# Altium project VISION_BETA_EBB.PrjPcb (part 8 of 9)

## Sheet PWR_MGMT_CAN_IF.SchDoc
size D; SheetNumber: 16; SheetTotal: 19
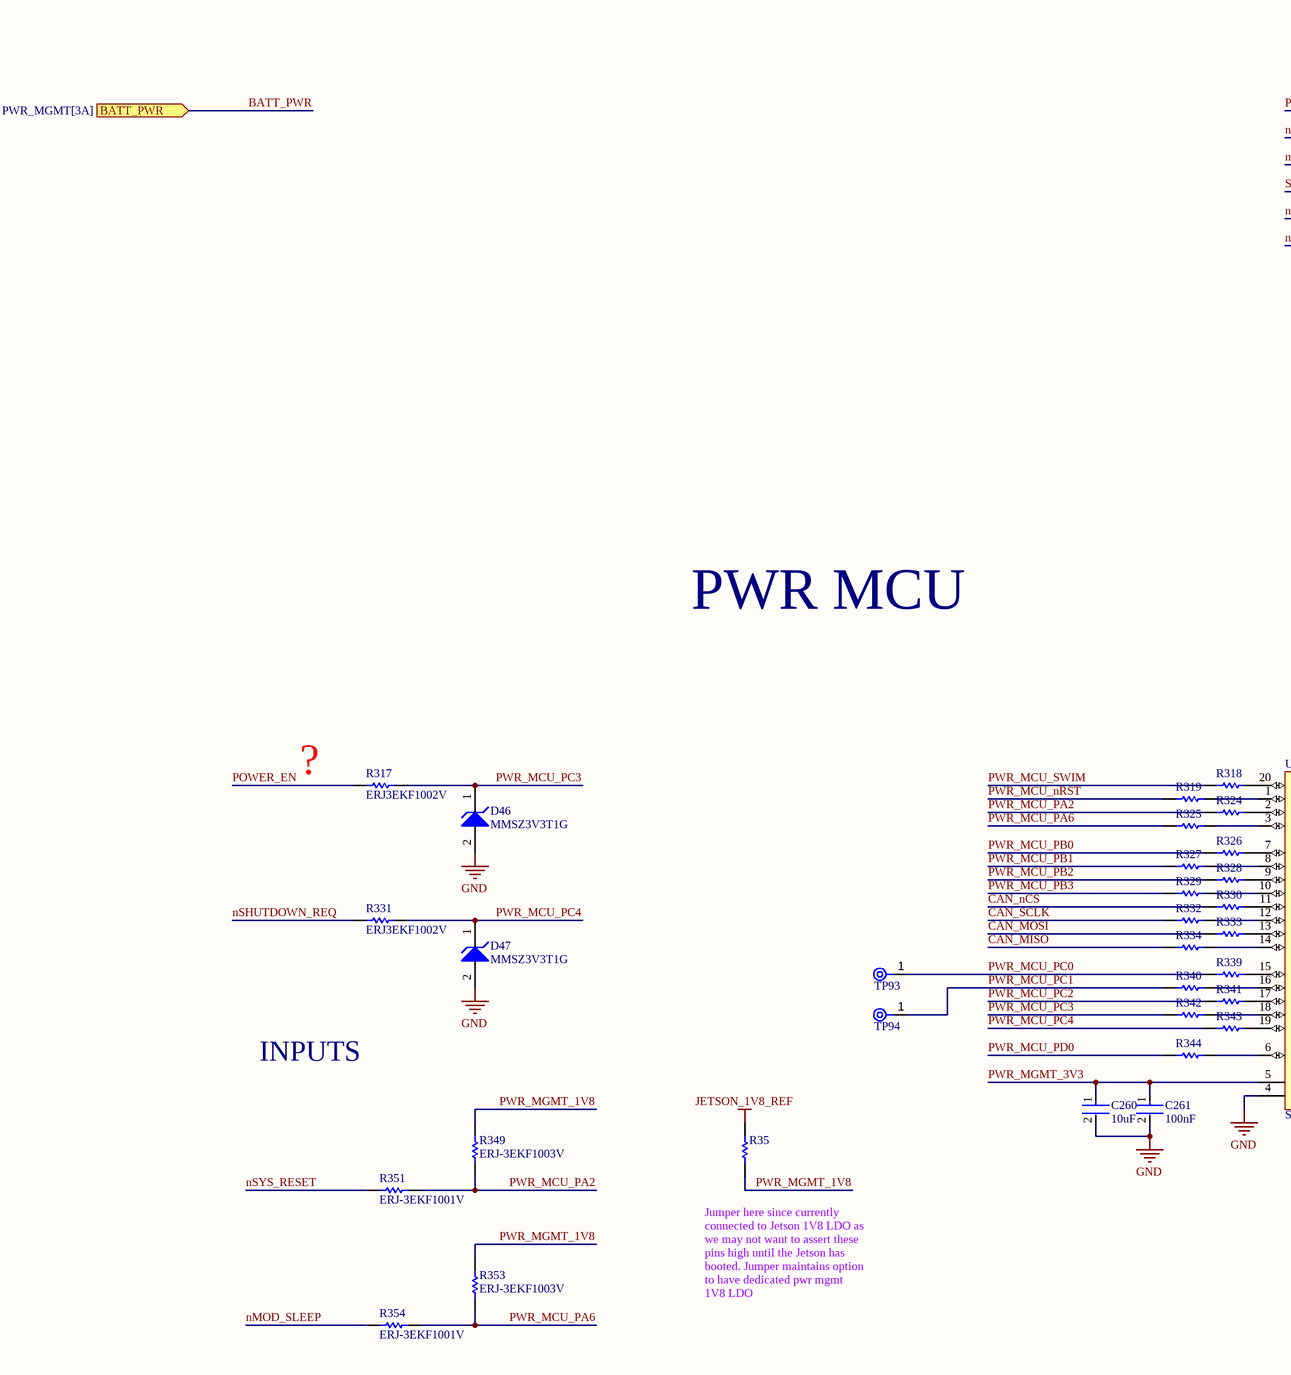
[diagram p39: PWR_MGMT_CAN_IF.SchDoc, top left]
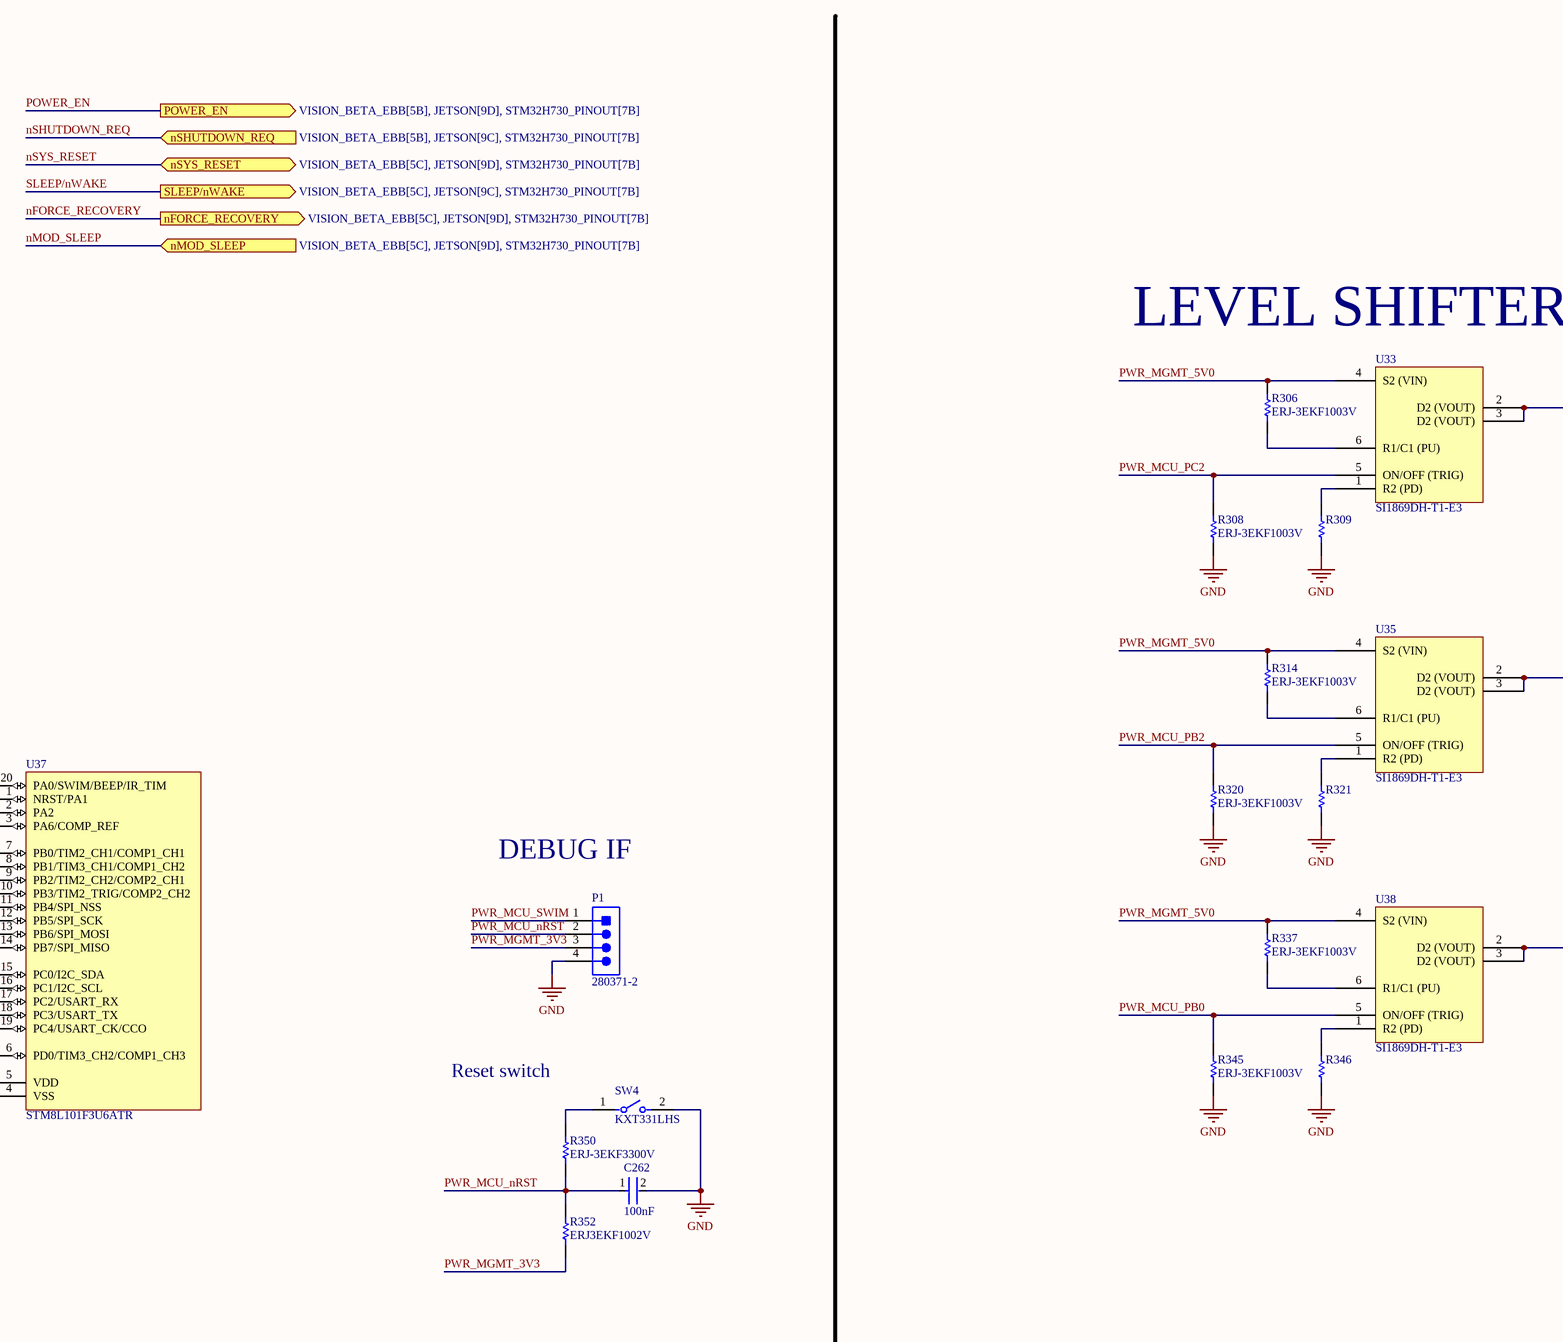
[diagram p40: PWR_MGMT_CAN_IF.SchDoc, top middle]
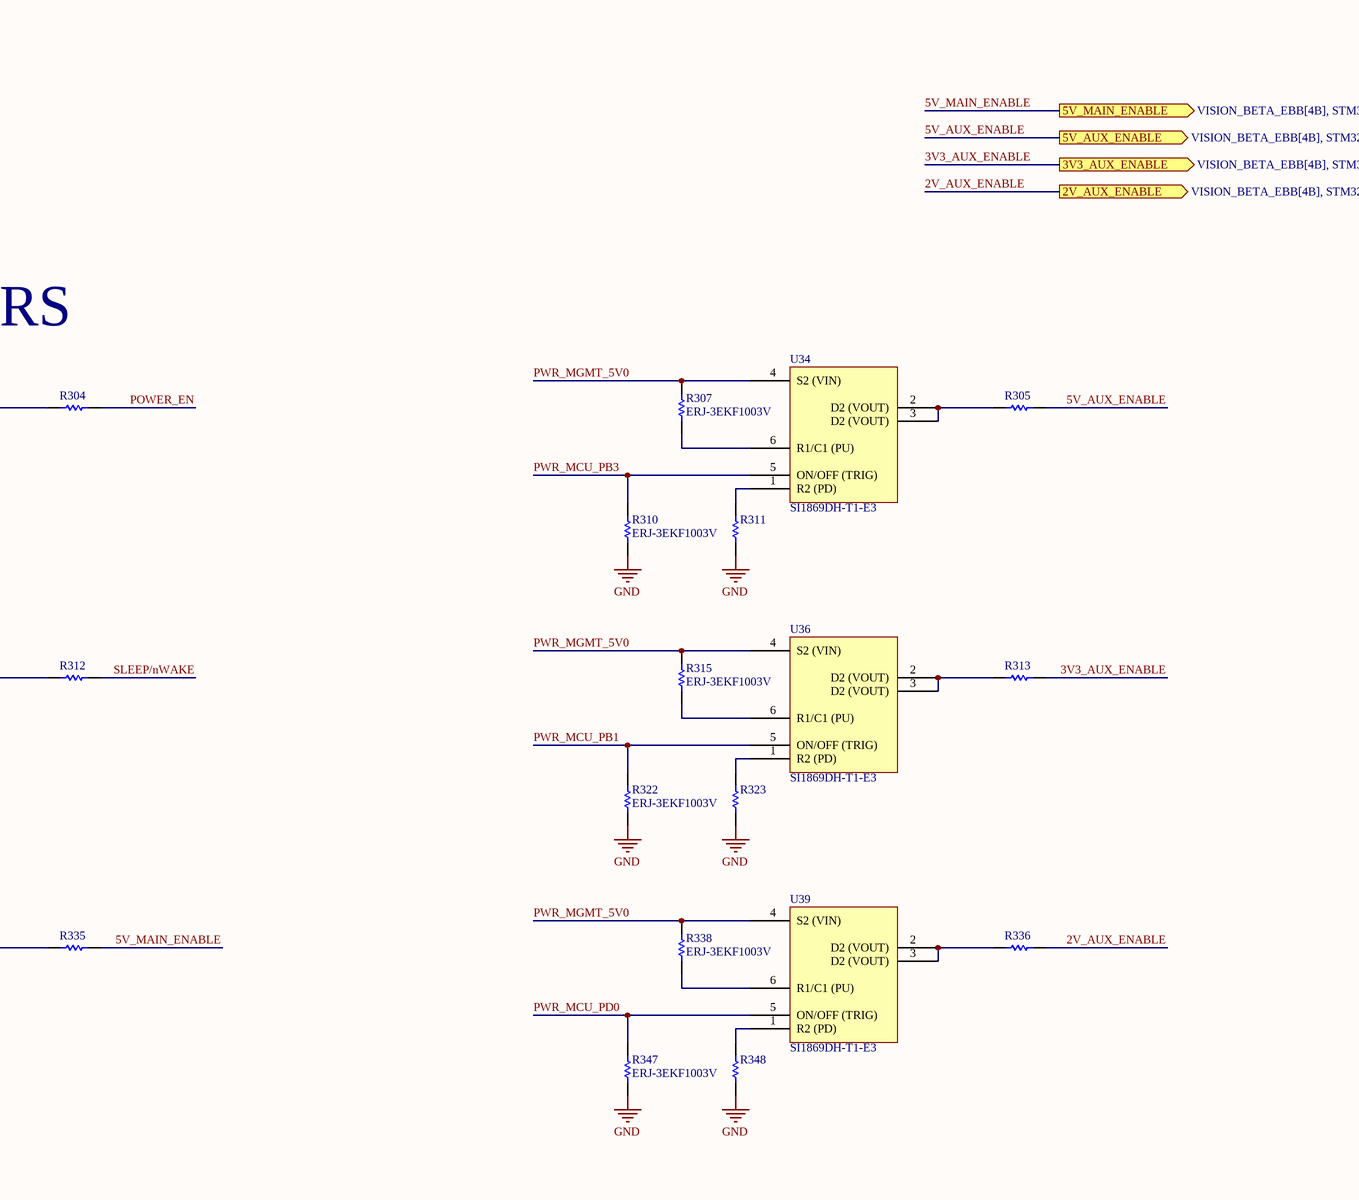
[diagram p41: PWR_MGMT_CAN_IF.SchDoc, top right]
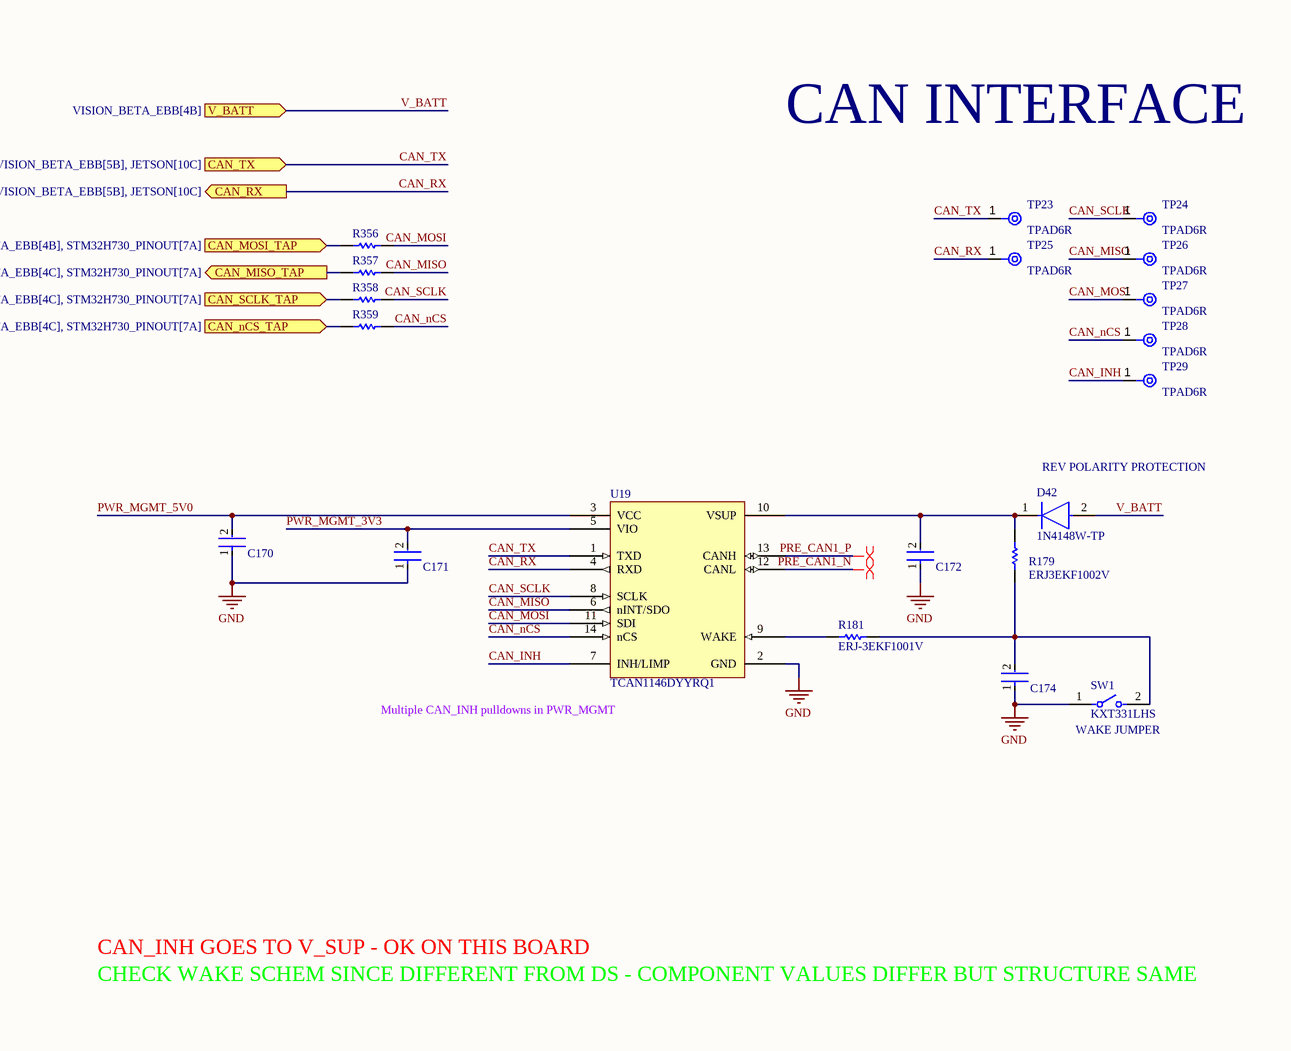
[diagram p42: PWR_MGMT_CAN_IF.SchDoc, bottom left]
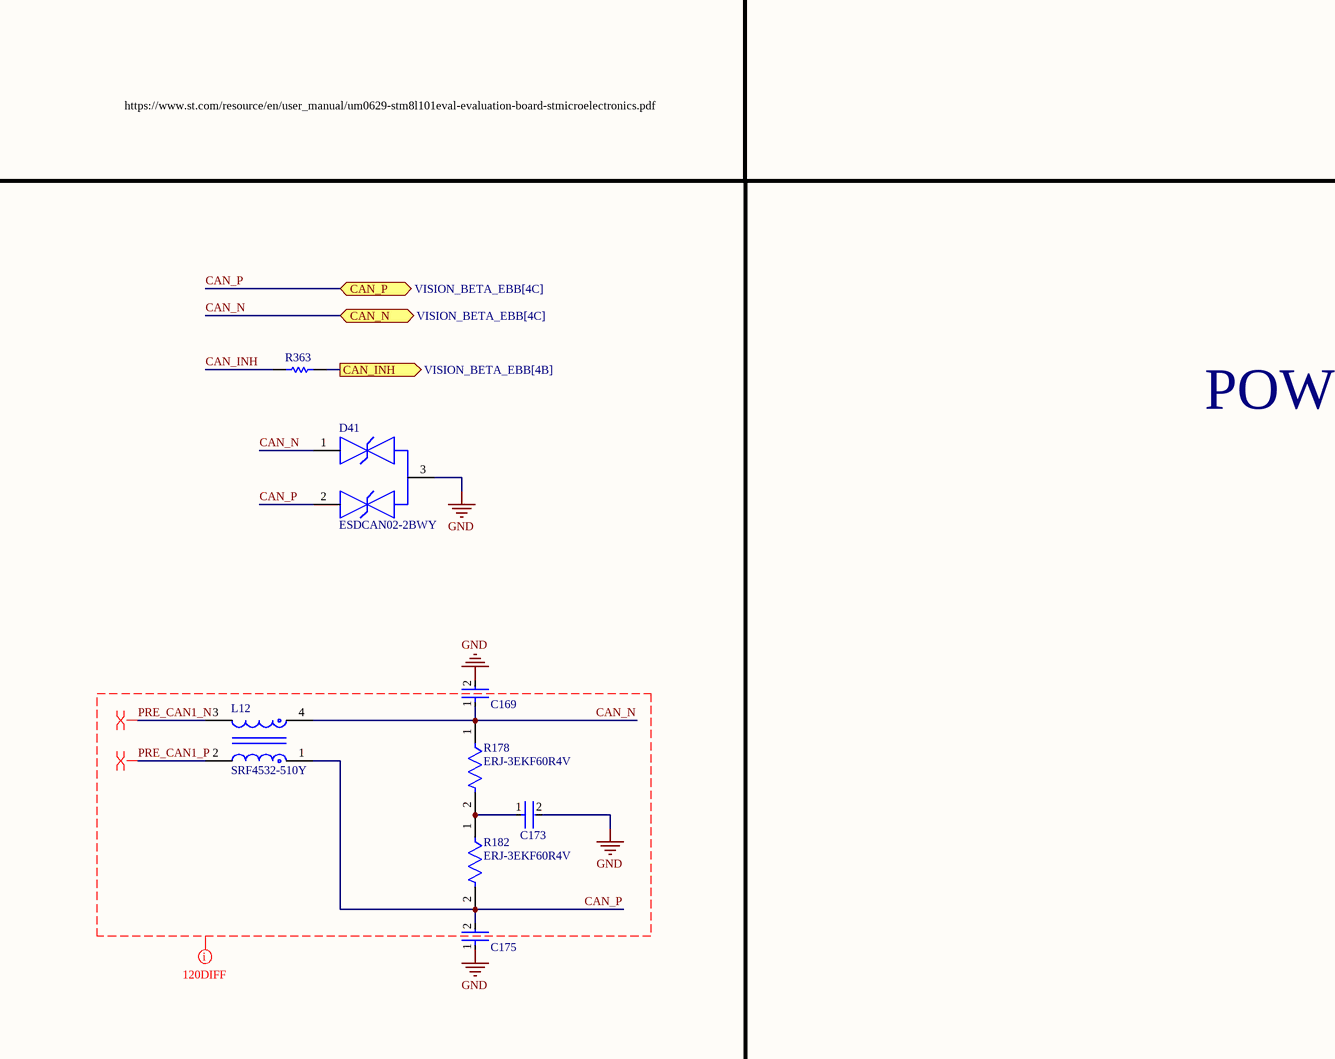
[diagram p43: PWR_MGMT_CAN_IF.SchDoc, bottom middle]
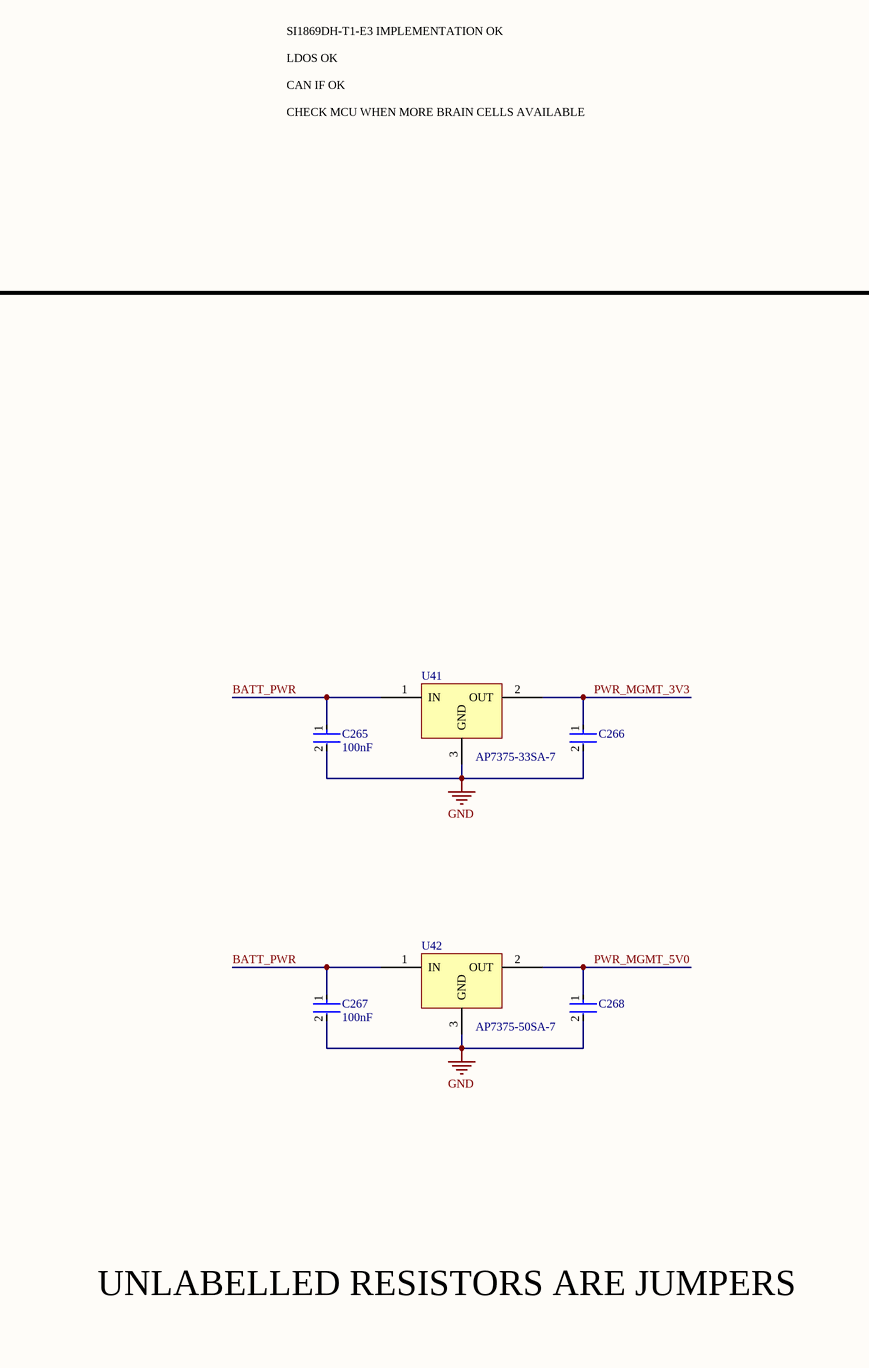
[diagram p44: PWR_MGMT_CAN_IF.SchDoc, bottom right]

### Parts
C169  C0402C104K8PACTU  [FP-C0402-BB-MFG]  (value not drawn)
C170  C0402C104K8PACTU  [FP-C0402-BB-MFG]  (value not drawn)
C171  C0402C104K8PACTU  [FP-C0402-BB-MFG]  (value not drawn)
C172  C0402C104K8PACTU  [FP-C0402-BB-MFG]  (value not drawn)
C173  C0402C104K8PACTU  [FP-C0402-BB-MFG]  (value not drawn)
C174  C0402C104K8PACTU  [FP-C0402-BB-MFG]  (value not drawn)
C175  C0402C104K8PACTU  [FP-C0402-BB-MFG]  (value not drawn)
C260  10uF  [FP-0402-L_1_0_0_05-W_0_5-IPC_A]
C261  100nF  [FP-0402-L_1_0_0_05-W_0_5-IPC_A]
C262  100nF  [FP-0402-L_1_0_0_05-W_0_5-IPC_A]
C265  100nF  [FP-0402-L_1_0_0_05-W_0_5-IPC_A]
C266  GRM188R61E106KA73D  [FP-GRM188-0_2-IPC_A]  (value not drawn)
C267  100nF  [FP-0402-L_1_0_0_05-W_0_5-IPC_A]
C268  GRM188R61E106KA73D  [FP-GRM188-0_2-IPC_A]  (value not drawn)
D41  ESDCAN02-2BWY  [FP-SOT323-3L-MFG]
D42  1N4148W-TP  [FP-SOD-123-IPC_A]
D46  MMSZ3V3T1G  [ONSC-SOD-123-2-425-04_V]
D47  MMSZ3V3T1G  [ONSC-SOD-123-2-425-04_V]
L12  SRF4532-510Y  [FP-SRF4532-MFG]
P1  280371-2  [TECO-280371-2_V]
R35  0402 JUMPER  [RESC1005X40X25ML05T05]  (value not drawn)
R178  ERJ-3EKF60R4V  [FP-ERJ3EK-IPC_C]
R179  ERJ3EKF1002V  [RESC1609X55X30LL15T15]
R181  ERJ-3EKF1001V  [RESC1608X55X30LL15T15]
R182  ERJ-3EKF60R4V  [FP-ERJ3EK-IPC_C]
R304  0402 JUMPER  [RESC1005X40X25ML05T05]  (value not drawn)
R305  0402 JUMPER  [RESC1005X40X25ML05T05]  (value not drawn)
R306  ERJ-3EKF1003V  [RESC1608X55X30ML15T15]
R307  ERJ-3EKF1003V  [RESC1608X55X30ML15T15]
R308  ERJ-3EKF1003V  [RESC1608X55X30ML15T15]
R309  0402 JUMPER  [RESC1005X40X25ML05T05]  (value not drawn)
R310  ERJ-3EKF1003V  [RESC1608X55X30ML15T15]
R311  0402 JUMPER  [RESC1005X40X25ML05T05]  (value not drawn)
R312  0402 JUMPER  [RESC1005X40X25ML05T05]  (value not drawn)
R313  0402 JUMPER  [RESC1005X40X25ML05T05]  (value not drawn)
R314  ERJ-3EKF1003V  [RESC1608X55X30ML15T15]
R315  ERJ-3EKF1003V  [RESC1608X55X30ML15T15]
R317  ERJ3EKF1002V  [RESC1609X55X30LL15T15]
R318  0402 JUMPER  [RESC1005X40X25ML05T05]  (value not drawn)
R319  0402 JUMPER  [RESC1005X40X25ML05T05]  (value not drawn)
R320  ERJ-3EKF1003V  [RESC1608X55X30ML15T15]
R321  0402 JUMPER  [RESC1005X40X25ML05T05]  (value not drawn)
R322  ERJ-3EKF1003V  [RESC1608X55X30ML15T15]
R323  0402 JUMPER  [RESC1005X40X25ML05T05]  (value not drawn)
R324  0402 JUMPER  [RESC1005X40X25ML05T05]  (value not drawn)
R325  0402 JUMPER  [RESC1005X40X25ML05T05]  (value not drawn)
R326  0402 JUMPER  [RESC1005X40X25ML05T05]  (value not drawn)
R327  0402 JUMPER  [RESC1005X40X25ML05T05]  (value not drawn)
R328  0402 JUMPER  [RESC1005X40X25ML05T05]  (value not drawn)
R329  0402 JUMPER  [RESC1005X40X25ML05T05]  (value not drawn)
R330  0402 JUMPER  [RESC1005X40X25ML05T05]  (value not drawn)
R331  ERJ3EKF1002V  [RESC1609X55X30LL15T15]
R332  0402 JUMPER  [RESC1005X40X25ML05T05]  (value not drawn)
R333  0402 JUMPER  [RESC1005X40X25ML05T05]  (value not drawn)
R334  0402 JUMPER  [RESC1005X40X25ML05T05]  (value not drawn)
R335  0402 JUMPER  [RESC1005X40X25ML05T05]  (value not drawn)
R336  0402 JUMPER  [RESC1005X40X25ML05T05]  (value not drawn)
R337  ERJ-3EKF1003V  [RESC1608X55X30ML15T15]
R338  ERJ-3EKF1003V  [RESC1608X55X30ML15T15]
R339  0402 JUMPER  [RESC1005X40X25ML05T05]  (value not drawn)
R340  0402 JUMPER  [RESC1005X40X25ML05T05]  (value not drawn)
R341  0402 JUMPER  [RESC1005X40X25ML05T05]  (value not drawn)
R342  0402 JUMPER  [RESC1005X40X25ML05T05]  (value not drawn)
R343  0402 JUMPER  [RESC1005X40X25ML05T05]  (value not drawn)
R344  0402 JUMPER  [RESC1005X40X25ML05T05]  (value not drawn)
R345  ERJ-3EKF1003V  [RESC1608X55X30ML15T15]
R346  0402 JUMPER  [RESC1005X40X25ML05T05]  (value not drawn)
R347  ERJ-3EKF1003V  [RESC1608X55X30ML15T15]
R348  0402 JUMPER  [RESC1005X40X25ML05T05]  (value not drawn)
R349  ERJ-3EKF1003V  [RESC1608X55X30ML15T15]
R350  ERJ-3EKF3300V  [RESC1608X55X30LL15T15]
R351  ERJ-3EKF1001V  [RESC1608X55X30LL15T15]
R352  ERJ3EKF1002V  [RESC1609X55X30LL15T15]
R353  ERJ-3EKF1003V  [RESC1608X55X30ML15T15]
R354  ERJ-3EKF1001V  [RESC1608X55X30LL15T15]
R356  0402 JUMPER  [RESC1005X40X25ML05T05]  (value not drawn)
R357  0402 JUMPER  [RESC1005X40X25ML05T05]  (value not drawn)
R358  0402 JUMPER  [RESC1005X40X25ML05T05]  (value not drawn)
R359  0402 JUMPER  [RESC1005X40X25ML05T05]  (value not drawn)
R363  0402 JUMPER  [RESC1005X40X25ML05T05]  (value not drawn)
SW1  KXT331LHS  [FP-KXT331LHS-MFG]
SW4  KXT331LHS  [FP-KXT331LHS-MFG]
TP23  TPAD6R  [New footprint 1]
TP24  TPAD6R  [New footprint 1]
TP25  TPAD6R  [New footprint 1]
TP26  TPAD6R  [New footprint 1]
TP27  TPAD6R  [New footprint 1]
TP28  TPAD6R  [New footprint 1]
TP29  TPAD6R  [New footprint 1]
TP93  TPAD6R  [New footprint 1]  (value not drawn)
TP94  TPAD6R  [New footprint 1]  (value not drawn)
U19  TCAN1146DYYRQ1  [TCAN1146DYYRQ1-Footprint-1]
U33  SI1869DH-T1-E3  [SOT65P242X110-6N]
U34  SI1869DH-T1-E3  [SOT65P242X110-6N]
U35  SI1869DH-T1-E3  [SOT65P242X110-6N]
U36  SI1869DH-T1-E3  [SOT65P242X110-6N]
U37  STM8L101F3U6ATR  [UFQFPN20_V]
U38  SI1869DH-T1-E3  [SOT65P242X110-6N]
U39  SI1869DH-T1-E3  [SOT65P242X110-6N]
U41  AP7375-33SA-7  [SOT90P285X110-3N]
U42  AP7375-50SA-7  [SOT90P285X110-3N]

### Ports
2V_AUX_ENABLE (out, see VISION_BETA_EBB[4B], STM32H730_PINOUT[8B]), 3V3_AUX_ENABLE (out, see VISION_BETA_EBB[4B], STM32H730_PINOUT[8B]), 5V_AUX_ENABLE (out, see VISION_BETA_EBB[4B], STM32H730_PINOUT[8B]), 5V_MAIN_ENABLE (out, see VISION_BETA_EBB[4B], STM32H730_PINOUT[8B]), BATT_PWR (in, see VISION_BETA_EBB[4B], PWR_MGMT[3A]), CAN_INH (out, see VISION_BETA_EBB[4B]), CAN_MISO_TAP (out, see VISION_BETA_EBB[4C], STM32H730_PINOUT[7A]), CAN_MOSI_TAP (in, see VISION_BETA_EBB[4B], STM32H730_PINOUT[7A]), CAN_N (bidir, see VISION_BETA_EBB[4C]), CAN_nCS_TAP (in, see VISION_BETA_EBB[4C], STM32H730_PINOUT[7A]), CAN_P (bidir, see VISION_BETA_EBB[4C]), CAN_RX (out, see VISION_BETA_EBB[5B], JETSON[10C]), CAN_SCLK_TAP (in, see VISION_BETA_EBB[4C], STM32H730_PINOUT[7A]), CAN_TX (in, see VISION_BETA_EBB[5B], JETSON[10C]), nFORCE_RECOVERY (out, see VISION_BETA_EBB[5C], JETSON[9D], STM32H730_PINOUT[7B]), nMOD_SLEEP (in, see VISION_BETA_EBB[5C], JETSON[9D], STM32H730_PINOUT[7B]), nSHUTDOWN_REQ (in, see VISION_BETA_EBB[5B], JETSON[9C], STM32H730_PINOUT[7B]), nSYS_RESET (bidir, see VISION_BETA_EBB[5C], JETSON[9D], STM32H730_PINOUT[7B]), POWER_EN (out, see VISION_BETA_EBB[5B], JETSON[9D], STM32H730_PINOUT[7B]), SLEEP/nWAKE (out, see VISION_BETA_EBB[5C], JETSON[9C], STM32H730_PINOUT[7B]), V_BATT (in, see VISION_BETA_EBB[4B])

### Nets
GND: C169.2 C170.1 C171.1 C172.1 C173.2 C174.1 C175.1 C260.2 C261.2 C262.2 C265.2 C266.2 C267.2 C268.2 D41.3 D46.2(A) D47.2(A) P1.4 R308.1 R309.2 R310.1 R311.2 R320.1 R321.2 R322.1 R323.2 R345.1 R346.2 R347.1 R348.2 SW1.1 SW4.2 U19.2(GND) U37.4(VSS) U41.3(GND) U42.3(GND)
JETSON_1V8_REF: R35.2  [project net FAN_VDDIO]
2V_AUX_ENABLE: R336.2 ; port 2V_AUX_ENABLE
3V3_AUX_ENABLE: R313.2 ; port 3V3_AUX_ENABLE
5V_AUX_ENABLE: R305.2 ; port 5V_AUX_ENABLE
5V_MAIN_ENABLE: R335.2 ; port 5V_MAIN_ENABLE  [project net 5V_ENABLE]
BATT_PWR: C265.1 C267.1 U41.1(IN) U42.1(IN) ; port BATT_PWR
CAN_INH: R363.1 TP29.1(TP) U19.7(INH/LIMP)
CAN_MISO: R334.1 R357.2 TP26.1(TP) U19.6(nINT/SDO)
CAN_MISO_TAP: R357.1 ; port CAN_MISO_TAP
CAN_MOSI: R333.1 R356.2 TP27.1(TP) U19.11(SDI)
CAN_MOSI_TAP: R356.1 ; port CAN_MOSI_TAP
CAN_N: C169.1 D41.1 L12.4 R178.1 ; port CAN_N
CAN_nCS: R330.1 R359.2 TP28.1(TP) U19.14(nCS)
CAN_nCS_TAP: R359.1 ; port CAN_nCS_TAP
CAN_P: C175.2 D41.2 L12.1 R182.2 ; port CAN_P
CAN_RX: TP25.1(TP) U19.4(RXD) ; port CAN_RX
CAN_SCLK: R332.1 R358.2 TP24.1(TP) U19.8(SCLK)
CAN_SCLK_TAP: R358.1 ; port CAN_SCLK_TAP
CAN_TX: TP23.1(TP) U19.1(TXD) ; port CAN_TX
ENABLE: R363.2 ; port CAN_INH
nMOD_SLEEP: R354.1 ; port nMOD_SLEEP  [project net HDMI_nSLEEP]
nSHUTDOWN_REQ: R331.1 ; port nSHUTDOWN_REQ
nSYS_RESET: R351.1 ; port nSYS_RESET
POWER_EN: R304.2 R317.1 ; port POWER_EN
PRE_CAN1_N: L12.3 U19.12(CANL)
PRE_CAN1_P: L12.2 U19.13(CANH)
PWR_MCU_nRST: C262.1 P1.2 R319.1 R350.1 R352.2
PWR_MCU_PA2: R324.1 R349.1 R351.2
PWR_MCU_PA6: R325.1 R353.1 R354.2
PWR_MCU_PB0: R326.1 R345.2 U38.5(ON/OFF_(TRIG))
PWR_MCU_PB1: R322.2 R327.1 U36.5(ON/OFF_(TRIG))
PWR_MCU_PB2: R320.2 R328.1 U35.5(ON/OFF_(TRIG))
PWR_MCU_PB3: R310.2 R329.1 U34.5(ON/OFF_(TRIG))
PWR_MCU_PC0: R339.1 TP93.1(TP)
PWR_MCU_PC1: R340.1 TP94.1(TP)
PWR_MCU_PC2: R308.2 R341.1 U33.5(ON/OFF_(TRIG))
PWR_MCU_PC3: D46.1(K) R317.2 R342.1
PWR_MCU_PC4: D47.1(K) R331.2 R343.1
PWR_MCU_PD0: R344.1 R347.2 U39.5(ON/OFF_(TRIG))
PWR_MCU_SWIM: P1.1 R318.1
PWR_MGMT_1V8: R35.1 R349.2 R353.2
PWR_MGMT_3V3: C171.2 C260.1 C261.1 C266.1 P1.3 R352.1 U19.5(VIO) U37.5(VDD) U41.2(OUT)
PWR_MGMT_5V0: C170.2 C268.1 R306.2 R307.2 R314.2 R315.2 R337.2 R338.2 U19.3(VCC) U33.4(S2_(VIN)) U34.4(S2_(VIN)) U35.4(S2_(VIN)) U36.4(S2_(VIN)) U38.4(S2_(VIN)) U39.4(S2_(VIN)) U42.2(OUT)
SLEEP/nWAKE: R312.2 ; port SLEEP/nWAKE
V_BATT: D42.2(A) ; port V_BATT  [project net CAN_PWR]
NetC172_2: C172.2 D42.1(C) R179.1 U19.10(VSUP)
NetC173_1: C173.1 R178.2 R182.1
NetC174_2: C174.2 R179.2 R181.2 SW1.2
NetR181_1: R181.1 U19.9(WAKE)
NetR304_1: R304.1 U33.2(D2_(VOUT)) U33.3(D2_(VOUT))
NetR305_1: R305.1 U34.2(D2_(VOUT)) U34.3(D2_(VOUT))
NetR306_1: R306.1 U33.6(R1/C1_(PU))
NetR307_1: R307.1 U34.6(R1/C1_(PU))
NetR309_1: R309.1 U33.1(R2_(PD))
NetR311_1: R311.1 U34.1(R2_(PD))
NetR312_1: R312.1 U35.2(D2_(VOUT)) U35.3(D2_(VOUT))
NetR313_1: R313.1 U36.2(D2_(VOUT)) U36.3(D2_(VOUT))
NetR314_1: R314.1 U35.6(R1/C1_(PU))
NetR315_1: R315.1 U36.6(R1/C1_(PU))
NetR318_2: R318.2 U37.20(PA0/SWIM/BEEP/IR_TIM)
NetR319_2: R319.2 U37.1(NRST/PA1)
NetR321_1: R321.1 U35.1(R2_(PD))
NetR323_1: R323.1 U36.1(R2_(PD))
NetR324_2: R324.2 U37.2(PA2)
NetR325_2: R325.2 U37.3(PA6/COMP_REF)
NetR326_2: R326.2 U37.7(PB0/TIM2_CH1/COMP1_CH1)
NetR327_2: R327.2 U37.8(PB1/TIM3_CH1/COMP1_CH2)
NetR328_2: R328.2 U37.9(PB2/TIM2_CH2/COMP2_CH1)
NetR329_2: R329.2 U37.10(PB3/TIM2_TRIG/COMP2_CH2)
NetR330_2: R330.2 U37.11(PB4/SPI_NSS)
NetR332_2: R332.2 U37.12(PB5/SPI_SCK)
NetR333_2: R333.2 U37.13(PB6/SPI_MOSI)
NetR334_2: R334.2 U37.14(PB7/SPI_MISO)
NetR335_1: R335.1 U38.2(D2_(VOUT)) U38.3(D2_(VOUT))
NetR336_1: R336.1 U39.2(D2_(VOUT)) U39.3(D2_(VOUT))
NetR337_1: R337.1 U38.6(R1/C1_(PU))
NetR338_1: R338.1 U39.6(R1/C1_(PU))
NetR339_2: R339.2 U37.15(PC0/I2C_SDA)
NetR340_2: R340.2 U37.16(PC1/I2C_SCL)
NetR341_2: R341.2 U37.17(PC2/USART_RX)
NetR342_2: R342.2 U37.18(PC3/USART_TX)
NetR343_2: R343.2 U37.19(PC4/USART_CK/CCO)
NetR344_2: R344.2 U37.6(PD0/TIM3_CH2/COMP1_CH3)
NetR346_1: R346.1 U38.1(R2_(PD))
NetR348_1: R348.1 U39.1(R2_(PD))
NetR350_2: R350.2 SW4.1

### Layout directives
differential pair: PRE_CAN1_N, PRE_CAN1_P
net class 120DIFF: CAN_N, CAN_P, GND, PRE_CAN1_N, PRE_CAN1_P

### Notes on the sheet
- LEVEL SHIFTERS
- PWR MCU
- (near R317) ?
- DEBUG IF
- INPUTS
- Reset switch
- (near R35) Jumper here since currently connected to Jetson 1V8 LDO as we may not want to assert these pins high until the Jetson has booted. Jumper maintains option to have dedicated pwr mgmt 1V8 LDO
- SI1869DH-T1-E3 IMPLEMENTATION OK
  LDOS OK
  CAN IF OK
  CHECK MCU WHEN MORE BRAIN CELLS AVAILABLE
- https://www.st.com/resource/en/user_manual/um0629-stm8l101eval-evaluation-board-stmicroelectronics.pdf
- CAN INTERFACE
- POWER
- (near D42) REV POLARITY PROTECTION
- (near U19) Multiple CAN_INH pulldowns in PWR_MGMT
- (near SW1) WAKE JUMPER
- CHECK WAKE SCHEM SINCE DIFFERENT FROM DS - COMPONENT VALUES DIFFER BUT STRUCTURE SAME
- CAN_INH GOES TO V_SUP - OK ON THIS BOARD
- UNLABELLED RESISTORS ARE JUMPERS

### Library data of the parts
C169-C175 = CMP-2008-02046-2: as C163-C168 on sheet ADC; Package: C0402-BB; Temperature: -55°C to +125°C; ComponentLink2Description: Datasheet; Temperature Characteristic: X5R; Device Class L1: Passive Components; Height: 0.55mm; Lead Free: Yes; ComponentLink2URL: https://content.kemet.com/datasheets/KEM_C1002_X7R_SMD.pdf; Device Class L2: Capacitors; Temperature Range Low: -55°C; Temperature Range High: +125°C; RoHS: TRUE; Octopart: https://octopart.com/c0402c104k8pactu-kemet-140039; Automotive: No; Mouser Description: Capacitor 100 nF 10 VDC 0402; Category: Cap; Voltage Rating: 10 V; Digikey Description: CAP CER 0.1UF 10V X5R 0402; Ipc Land Pattern Name: CAPC10050X50; Device Class L3: Ceramic Capacitors; Manufacturer Part Number: C0402C104K8PACTU
C260-C262 C265 C267 = CMP-001-00058-1: LARGE PADS, 0402 CAP, CHANGE COMMENT TO MATCH REAL P/N; Capacitor Type: Ceramic; Min Operating Temperature: -55°C; Mounting Technology: Surface Mount; Pins: 2; Case/Package: 0402; RoHS Compliant: Yes; Max Operating Temperature: 85°C
C266 C268 = CMP-06035-045268-1: Chip Multilayer Ceramic Capacitors for General Purpose, 0603, 10uF, X5R, 15%, 10%, 25V; Case/Package: 0603
D41 = CMP-12225-000055-1: TVS DIODE 26.5V 44V SOT323-3; Manufacturer: STMicroelectronics; Value: 3pF; Direction: Bidirectional; Breakdown Voltage: 28.5V; Automotive Grade: Grade 0; Standoff Height: 0mm; Peak Pulse Power: 170W; Peak Pulse Current: 3A; Number Of Channels: 2; Max Junction Temp: +175°C; Mouser Description: TVS Diodes / ESD Suppressors Automotive dual-line Transil, Transient voltage suppressor (TVS) for CAN bus; Height: 1.1mm; Category: Diode; Reverse Standoff Voltage: 26.5V; Device Class L1: Circuit Protection; Temperature: -55°C to +175°C; RoHS: TRUE; ComponentLink2URL: https://www.st.com/resource/en/datasheet/esdcan02-2bwy.pdf; Device Class L3: unset; Device Class L2: TVS Diodes; Temperature Range High: +175°C; Octopart: https://octopart.com/esdcan02-2bwy-stmicroelectronics-58631133; Ipc Land Pattern Name: SOT65P210X95-3; Temperature Range Low: -55°C; Capacitance: 3pF; Digikey Description: TVS DIODE 26.5V 44V SOT323-3; Automotive: Yes; ComponentLink2Description: Datasheet; Clamping Voltage: 44V; Manufacturer Part Number: ESDCAN02-2BWY; Lead Free: Yes; Package: SOT323-3L
D42 = CMP-2000-04993-2: DIODE GEN PURP 100V 150MA SOD123; Max Reverse Leakage Current: 5uA; Max Surge Current: 2A; Reverse Recovery Time: 4ns; Polarity: Standard; Capacitance: 4pF; Max Forward Surge Current (Ifsm): 1A; Element Configuration: Single; Power Dissipation: 400mW; Forward Voltage: 1V; Radiation Hardening: No; Lead Free: Lead Free; Max Reverse Voltage (DC): 100V; Current Rating: 150mA; Forward Current: 150mA; Packaging: Tape and Reel; Number of Pins: 2; Package Quantity: 3000; Max Operating Temperature: 150°C; Min Operating Temperature: -65°C; Average Rectified Current: 150mA; Recovery Time: 4ns; Output Current: 150mA; Peak Non-Repetitive Surge Current: 2A; Width: 1.8mm; Voltage Rating (DC): 100V; Height: 1.2mm; Max Repetitive Reverse Voltage (Vrrm): 100V; Mount: Surface Mount; Length: 2.85mm
D46 D47 = CMP-1060-00515-1: Zener Voltage Regulator, 500 mW, 2-Pin SOD-123, Pb-Free, Tape and Reel; Manufacturer: On Semiconductor; P Max (W): 0.5; ComponentLink3URL: http://www.onsemi.com/pub_link/Collateral/425-04.PDF; ComponentLink2Description: Datasheet; DatasheetVersion: Rev. 11; ComponentLink1URL: http://www.onsemi.com/; PackageDescription: 2-Pin SOD, Body 1.6 x 2.69 mm; Mounting Technology: Surface Mount; ComponentLink3Description: Package Specification; ComponentLink1Description: Manufacturer URL; Packing: Tape and Reel; ComponentLink2URL: http://www.onsemi.com/pub_link/Collateral/MMSZ2V4T1-D.PDF; PartNumber: MMSZ3V3T1G; PackageReference: SOD-123-2-425-04; PackageVersion: Rev. G, 10/2009; RoHS: Pb-Free
L12 = CMP-07251-000006-1: CMC 51UH 200MA 2LN 2KOHM SMD; Element Configuration: Dual; Number of Lines: 2; Core Material: Ferrite; Impedance: 2kR; Test Frequency: 100kHz; Voltage Rating (DC): 50V; Insulation Resistance: 10MR; Material: Steel; Tolerance: 50%; DC Resistance (DCR): 3.5R; RoHS Compliant: Yes; Mount: Surface Mount; REACH SVHC: No SVHC; Termination: SMD/SMT; DC Current: 200mA; Current: 200mA; Lead Free: Lead Free; Contact Plating: Tin; Length: 4.5mm; Max DC Current: 200mA; Width: 0.126inch; Case/Package: 4532; Packaging: Tape and Reel; Package Quantity: 1; Min Operating Temperature: -40°C; Depth: 3.4mm; Series: SRF4532; Max Operating Temperature: 125°C; Current Rating: 200mA; Self Resonant Frequency: 100kHz; Height: 0.118inch; Inductance: 51uH; Resistance: 2kR
P1 = CMP-2000-05548-1: Male Header, Pitch 2.54 mm, 1 x 4 Position, Height 12.8 mm, Tail Length 3.5 mm, -55 to 105 degC, RoHS, Bulk; Manufacturer: TE Connectivity; Pitch: 0.100"(2.54mm); Connector Type: Header,Shrouded; Other Names: 280371-2-ND / A106401; Number of Positions Loaded: All; Dynamic Catalog: AMPMODUModIISeries; Number of Positions: 4; 3D Model: 280371-2.pdf; Termination: Solder; Package Description: Male Header, Pitch 2.54 mm, 1 x 4 Position, Height 12.8 mm, Tail Length 3.5 mm; Datasheet Version: Rev. M1, 08/2016; Contact Mating Length: 0.260"(6.60mm); Datasheet URL: http://www.te.com/commerce/DocumentDelivery/DDEController?Action=showdoc&DocId=Customer+Drawing%7F280370%7FM1%7Fpdf%7FEnglish%7FENG_CD_280370_M1.pdf%7F280371-2; Mounting Technology: ThroughHole; Standard Package: 1,000; Contact Finish Thickness: 15µin(0.38µm); Contact Finish: Gold; Contact Type: MalePin; Packaging: Bulk; Mounting Type: ThroughHole; Number of Rows: 1; Family: RectangularConnectors-Headers,MalePins; Manufacturer URL: http://www.te.com/; Color: Black; RoHS Information: 280371-2StatementofCompliance; Package Reference: 280371-2; Category: Connectors,Interconnects; Series: AMPMODUModII
R35 R304 R305 R309 R311-R313 R318 R319 R321 R323-R330 R332-R336 R339-R344 R346 R348 R356-R359 R363 = CMP-009-00118-2: READ THE NAME; Pins: 2; Component Type: Standard; Design Item ID: CMP-009-00206-2; Source: 0402jump.SchLib
R178 R182 = CMP-1012-00372-3: RES SMD 60.4 OHM 1% 1/10W 0603; Resistance: 60.4R; Voltage Rating (DC): 50V; Voltage Rating: 75V; Temperature Coefficient: 100ppm/°C; Power Rating: 100mW; Mount: Surface Mount; Number of Terminations: 2; Max Operating Temperature: 155°C; Case Code (Metric): 1608; Height: 0.022inch; Case/Package: 0603; Min Operating Temperature: -55°C; REACH SVHC: No SVHC; Series: ERJ; Features: Automotive AEC-Q200; Military Standard: Not; Lead Free: Lead Free; Width: 0.031inch; Case Code (Imperial): 0603; Resistance Tolerance: 1%; Packaging: Tape and Reel; Termination: SMD/SMT; Tolerance: 1%; Contact Plating: Tin; Depth: 0.8mm; Resistor Type: Thick Film; Construction: Rectangular; RoHS Compliant: Yes; Max Power Dissipation: 100mW; Package Quantity: 1; Length: 1.6mm
R179 R317 R331 R352 = CMP-1012-00623-3: as R129 on sheet 5V_REG; Number of Pins: 2; Package Reference: 603; Depth: 0.8mm; Mount: SurfaceMount; Package Description: 2-Pin Surface Mount Device, Body 1.6 x 0.85 mm; Datasheet Version: 02/2017; Length: 1.6mm; Lead Free: LeadFree; Height: 0.45mm; Number of Terminations: 2; Max Power Dissipation: 100mW; Min Operating Temperature: -55degC; Datasheet URL: https://industrial.panasonic.com/cdbs/www-data/pdf/RDA0000/AOA0000C304.pdf; Termination: SMD/SMT; Case Code (Metric): 1608; Case Code (Imperial): 0603; Tolerance: 1%; Max Operating Temperature: 155degC; RoHSCompliant: true; Voltage Rating (DC): 75V; Radiation Hardening: No; Packaging: TapeandReel; Composition: ThickFilm; Mounting Technology: SurfaceMount; Manufacturer URL: http://www.panasonic.com/; Width: 0.031inch; REACH SVHC: NoSVHC; Contact Plating: Tin; Military Standard: Not; Package Quantity: 1
R181 R351 R354 = CMP-2000-00180-1: Manufacturer: Panasonic; Part Number: ERJ-3EKF1001V
R306-R308 R310 R314 R315 R320 R322 R337 R338 R345 R347 R349 R353 = CMP-2000-00182-1: Manufacturer: Panasonic; Part Number: ERJ-3EKF1003V
R350 = CMP-2000-00435-2: Chip Resistor, 330 Ohm, +/- 1%, 0.1 W, -55 to 155 degC, 0603 (1608 Metric), RoHS, Tape and Reel; Gender: Male; Mating Cycles: 10000; Current Rating: 500 mA; Voltage Rating: 10 V; REACH SVHC: No SVHC; PackageDescription: 2-Pin Surface Mount Device, Body 1.6 x 0.85 mm; Contact Finish: Gold; Pins: 8; ComponentLink1Description: Manufacturer URL; Packaging: Tape and Reel; Max Operating Temperature: 85 degC; Contact Material: Copper; Height: 1.45 mm; Width: 1.45 mm; DatasheetVersion: Apr-15; Package Quantity: 1500; Contact Plating: Gold; PackageReference: 0603; Mount: Surface Mount; Lead Pitch: 1.1 mm; Min Operating Temperature: -25 degC; ComponentLink1URL: http://www.panasonic.com/; ComponentLink2URL: http://industrial.panasonic.com/cdbs/www-data/pdf/RDA0000/AOA0000C86.pdf; Length: 13.7 mm; ComponentLink2Description: Datasheet; RoHSCompliant: true
SW1 SW4 = CMP-10040-000029-1: SWITCH TACTILE SPST-NO 0.02A 15V; Operating Force: 240gf; Switch Travel: 0.13mm; Illumination Type: Non-Illuminated; Throw Configuration: SPST; Number of Ports: 1; Current Rating: 5A; Mechanical Life: 500000Cycles; Switch Function: Off-Mom; Connector Type: USB; Actuator Type: Standard; Gender: Receptacle; Number of Contacts: 24; Contact Plating: Gold; Insulation Color: Black; Min Operating Temperature: -40°C; Packaging: Tape and Reel; Flammability Rating: UL94 V-0; Max Operating Temperature: 85°C; Termination: Solder; Mount: Surface Mount
TP23-TP29 TP93 TP94 = CMP-00025-2: Test Point .6mm
U19 = CMP-318-000000-2: Automotive CAN FD transceiver with watchdog, bus diagnostics and partial networking via sele 14-SOT-23-THIN -40 to 150; Component Type: Standard; Design Item ID: CMP-015-00012-2; Pin Count: 14; Source: TCAN1146DYYRQ1.SchLib
U33-U36 U38 U39 = CMP-019-00043-2: as U32 on sheet FAN_IF; Case/Package: TSSOP; Pins: 6; RoHS Compliant: Yes
U37 = CMP-0235-00019-1: STM8L ARM-based EnergyLite 8-bit MCU, 8 kB Flash, 1.5 kB Internal RAM, -40 to +85°C Temperature, 20-pin UFQFPN, Tape and Reel, COMP_REF available; ComponentLink3URL: http://www.st.com/internet/com/home/home.jsp; ComponentLink3Description: st.com Home; ComponentLink2URL: http://www.st.com/internet/mcu/subclass/1381.jsp; PackageVersion: 2010; PackageDescription: 20-Pin Ultra Thin Fine Pitch Quad Flat No-Lead, 3 x 3 x 0.55 mm Body, 0.5 mm Pitch; ComponentLink2Description: STM8L Family Web Page; PackageReference: UFQFPN20; ComponentLink1Description: STM8L101 Datasheet; ComponentLink1URL: http://www.st.com/internet/com/TECHNICAL_RESOURCES/TECHNICAL_LITERATURE/DATASHEET/CD00220591.pdf
U41 = CMP-019-00039-1: LDO Regulator Pos 3.3V 0.3A 3-Pin SOT-23 T/R
U42 = CMP-019-00039-1: MODIFIED COMMENT, 5V0 REG